# EAGLE design LED Module (EAGLE 9.5.2)
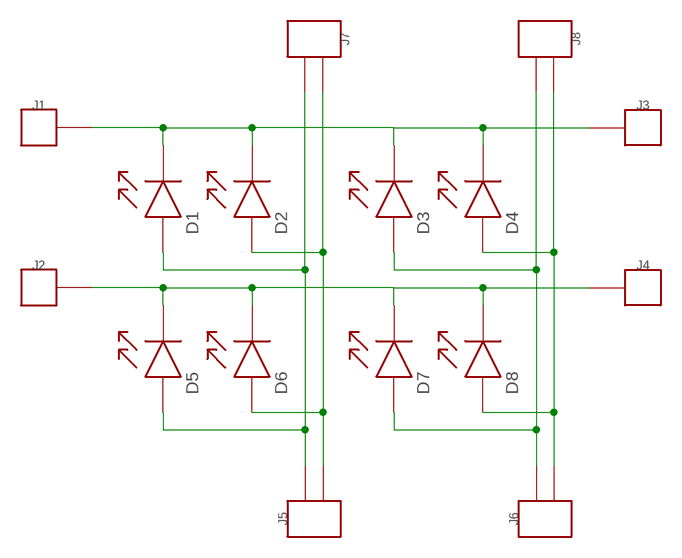
[diagram p0: schematic, sheet 1]

## Parts
D1  LED  [0805-POL]
D2  LED  [0805-POL]
D3  LED  [0805-POL]
D4  LED  [0805-POL]
D5  LED  [0805-POL]
D6  LED  [0805-POL]
D7  LED  [0805-POL]
D8  LED  [0805-POL]
J1  LED_JUMPER_1  [LED_JUMPER_1]
J2  LED_JUMPER_1  [LED_JUMPER_1]
J3  LED_JUMPER_1  [LED_JUMPER_1]
J4  LED_JUMPER_1  [LED_JUMPER_1]
J5  LED_JUMPER_2  [LED_JUMPER_2]
J6  LED_JUMPER_2  [LED_JUMPER_2]
J7  LED_JUMPER_2  [LED_JUMPER_2]
J8  LED_JUMPER_2  [LED_JUMPER_2]

## Nets
N$4: D1.+(K) D2.+(K) D3.+(K) D4.+(K) J1.1 J3.1
N$7: D1.COM(A) D5.COM(A) J5.1 J7.2
N$8: D2.COM(A) D6.COM(A) J5.2 J7.1
N$9: D5.+(K) D6.+(K) D7.+(K) D8.+(K) J2.1 J4.1
N$10: D3.COM(A) D7.COM(A) J6.1 J8.2
N$11: D4.COM(A) D8.COM(A) J6.2 J8.1

## Library data of the parts
D1-D8 = Zach:LED
J1-J4 = Zach:LED_JUMPER_1
J5-J8 = Zach:LED_JUMPER_2

## Board
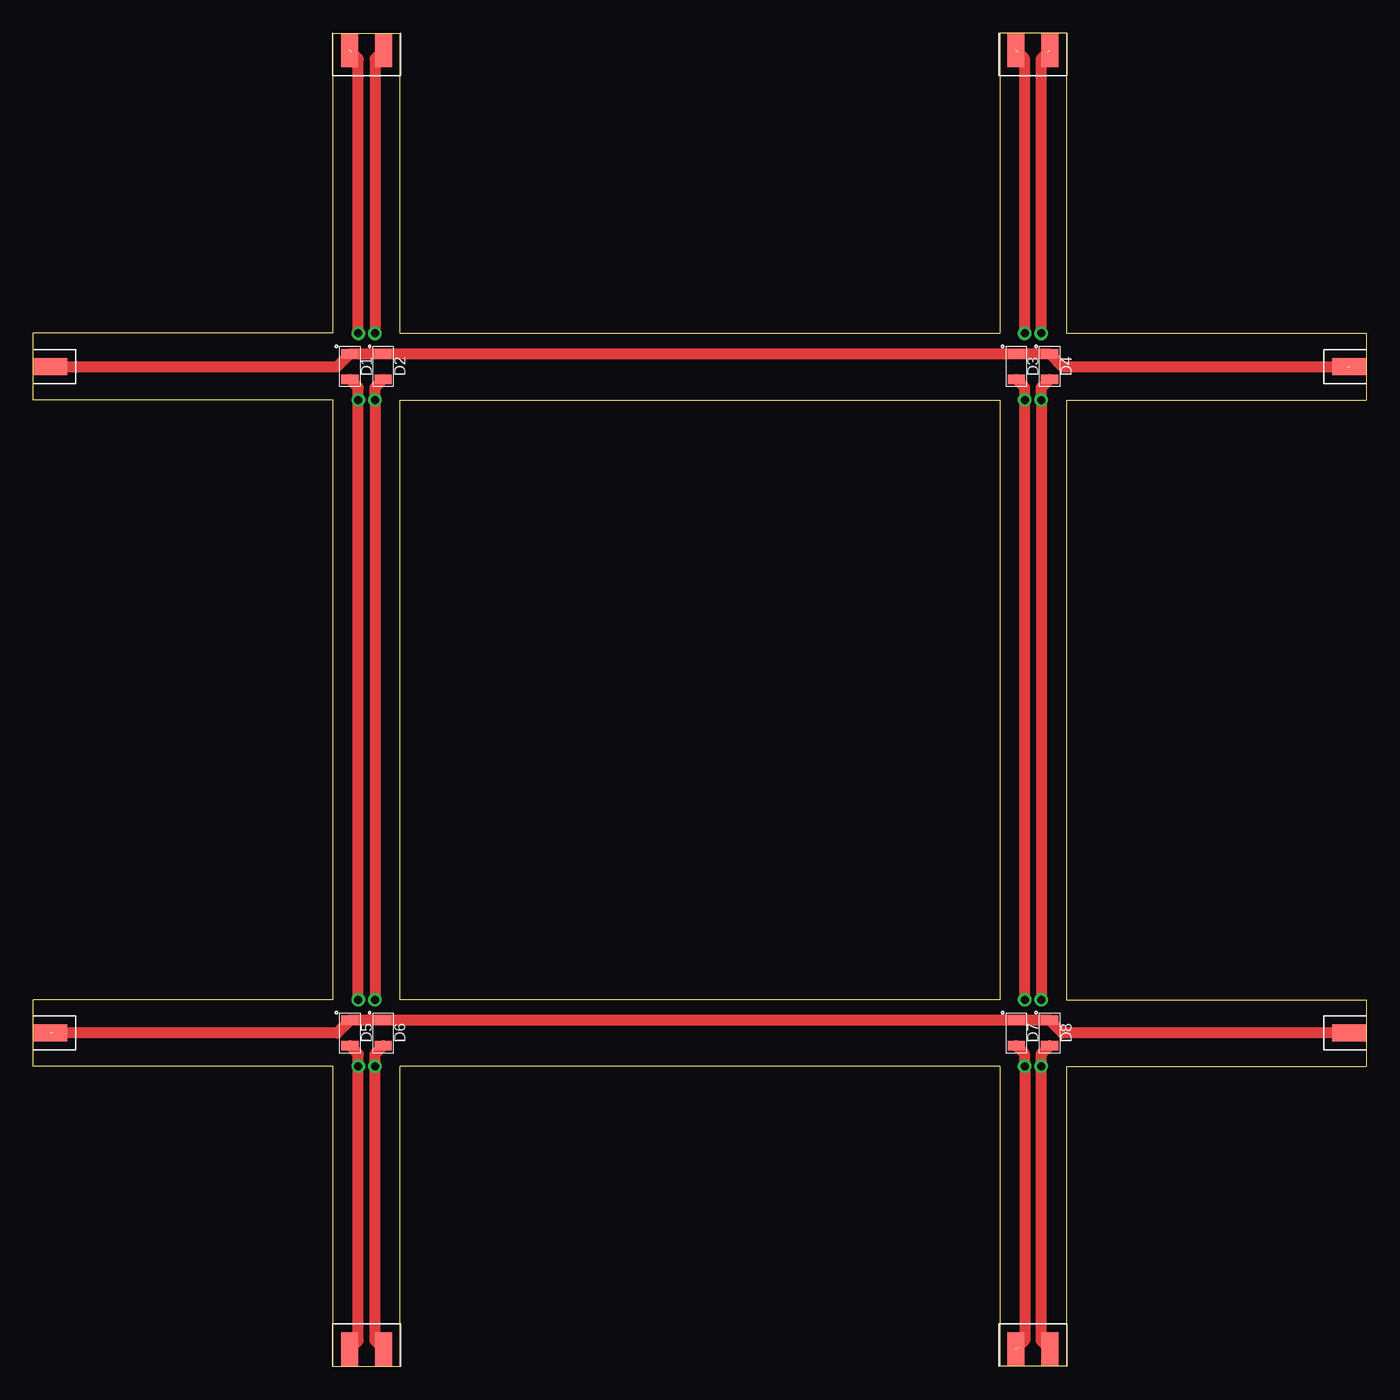
[diagram p1: board, top side]
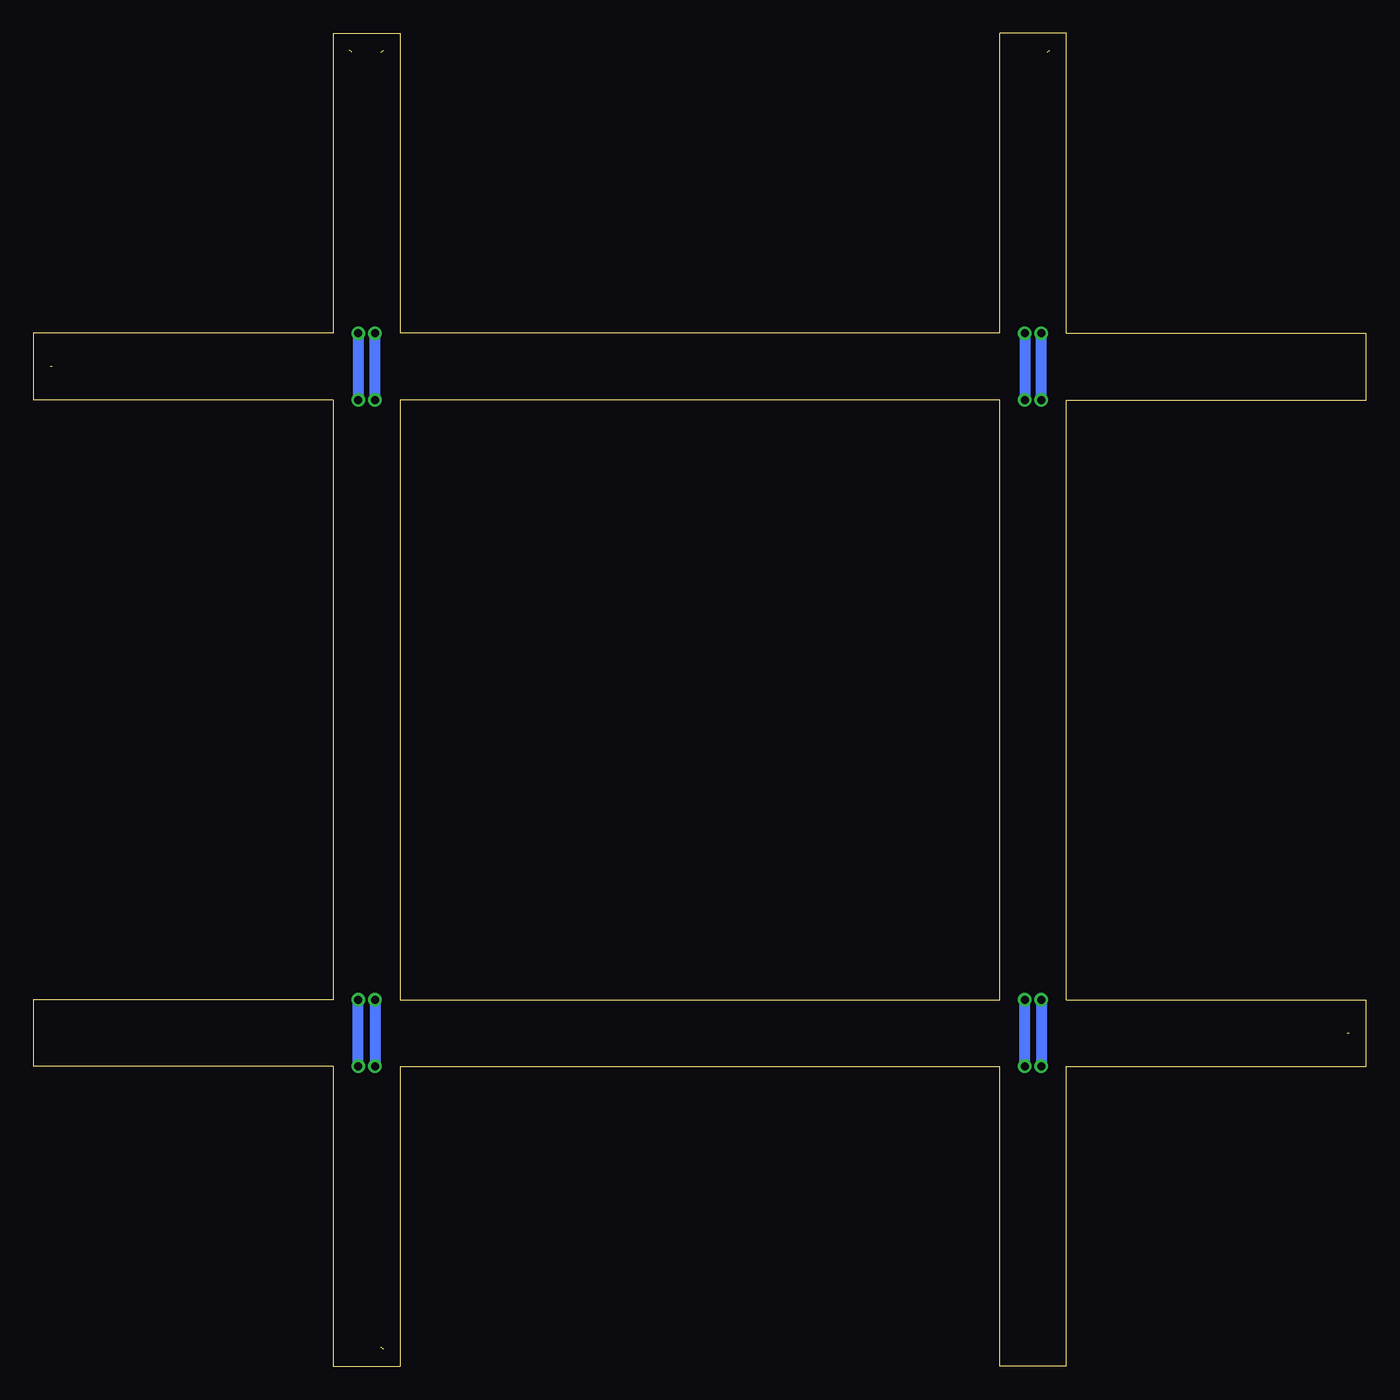
[diagram p2: board, bottom side, seen from below]

Size 100 x 100 mm. Coordinates in mm from the lower left corner, seen from the top.
Outline: 22.5,0 22.5,22.5 0,22.5 0,27.5 22.5,27.5 22.5,72.5 0,72.5 0,77.5 22.5,77.5 22.5,100 27.5,100 27.5,77.5 72.5,77.5 72.5,100 77.5,100 77.5,77.5 100,77.5 100,72.5 77.5,72.5 77.5,27.5 100,27.5 100,22.5 77.5,22.5 77.5,0 72.5,0 72.5,22.5 27.5,22.5 27.5,0 22.5,0
Outline: 27.5,27.5 27.5,72.5 72.5,72.5 72.5,27.5 27.5,27.5
Copper layers (1*16): Top 0.035mm / dielectric 1.5mm / Bottom 0.035mm
Design rules "default": minimum track width 6mil, minimum drill 0.35mm, track to track 6mil, track to pad 6mil, pad to pad 6mil, via to via 6mil, smd to smd 6mil, copper to edge 40mil, drill to drill 6mil, minimum pad ring 10mil, minimum via ring 8mil, stop-mask expansion 4mil, vias tented up to drill 0mil, thermal gap 10mil

### Footprints (pad centres in the part's own frame; a part is rotated, then mirrored left to right if it is on the bottom)
0805-POL = smd 0.711 x 1.295: + -0.953,0; COM 0.953,0
LED_JUMPER_1 = smd 1.27 x 2.54: 1 0,1.27
LED_JUMPER_2 = smd 1.27 x 2.54: 1 -1.27,1.27; 2 1.27,1.27

### Placement (x,y rotation side)
D1  23.75,75 270 top
D2  26.25,75 270 top
D3  73.75,75 270 top
D4  76.25,75 270 top
D5  23.75,25 270 top
D6  26.25,25 270 top
D7  73.75,25 270 top
D8  76.25,25 270 top
J1  0,75 270 top
J2  0,25 270 top
J3  100,75 90 top
J4  100,25 90 top
J5  25,0 0 top
J6  75,0 0 top
J7  25,100 180 top
J8  75,100 180 top

### Tracks (layer width: path | path; a pad name or v marks a point on that pad's centre or on a via)
N$4  (1 unrouted)
  Top 0.813: J1.1 22.8,75 D1.+ D2.+ D3.+ D4.+ 77.2,75 98.58,75
N$7  (via drill 0.6)  (1 unrouted)
  Top 0.813: J5.1 24.38,1.92 v24.38,22.5 24.38,23.42 D5.COM | v24.38,27.5 v24.38,72.5 24.38,73.42 D1.COM | v24.38,77.5 24.38,98.08 23.92,98.54 23.92,98.58
  Bottom 0.813: v24.38,27.5 v24.38,22.5 | v24.38,72.5 v24.38,77.5
N$8  (via drill 0.6)
  Top 0.813: J5.2 25.62,1.92 v25.62,22.5 25.62,23.42 D6.COM | v25.62,27.5 v25.62,72.5 25.62,73.42 D2.COM | J7.1 25.62,98.08 v25.62,77.5
  Bottom 0.813: v25.62,22.5 v25.62,27.5 | v25.62,77.5 v25.62,72.5
N$9  (1 unrouted)
  Top 0.813: J4.1 77.2,25 D8.+ D7.+ D6.+ D5.+ 22.8,25 1.42,25
N$10  (via drill 0.6)  (2 unrouted)
  Top 0.813: v74.38,27.5 v74.38,72.5 74.38,73.42 D3.COM | v74.38,77.5 74.38,98.08 73.92,98.54 73.92,98.58 | D7.COM 74.38,23.42 v74.38,22.5 74.38,1.92 73.92,1.46 73.92,1.42
  Bottom 0.813: v74.38,72.5 v74.38,77.5 | v74.38,27.5 v74.38,22.5
N$11  (via drill 0.6)  (1 unrouted)
  Top 0.813: v75.62,27.5 v75.62,72.5 75.62,73.42 D4.COM | v75.62,77.5 75.62,98.08 76.08,98.54 76.08,98.58 | D8.COM 75.62,23.42 v75.62,22.5 75.62,1.92 J6.2
  Bottom 0.813: v75.62,77.5 v75.62,72.5 | v75.62,22.5 v75.62,27.5